# EAGLE schematic alt-com (EAGLE 7.2.0)
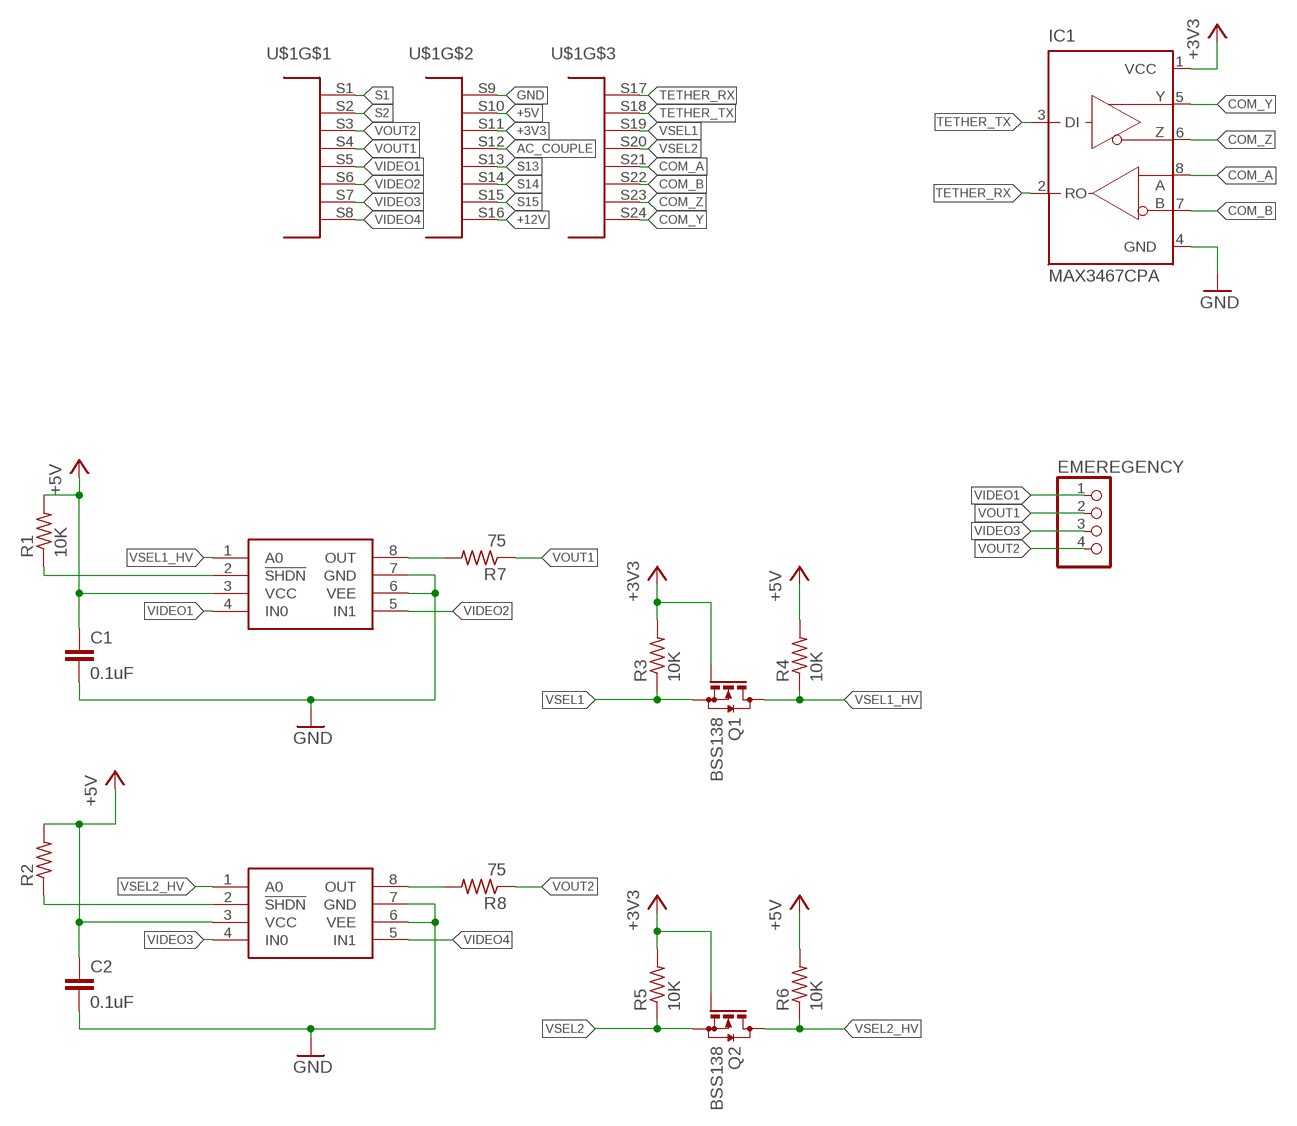
[diagram p0: schematic, sheet 1]

## Parts
C1  0.1uF  C-EUC0603  [C0603]
C2  0.1uF  C-EUC0603  [C0603]
EMEREGENCY  PINHD-1X4  [1X04]
IC1  MAX3467CPA  [SO08]
Q1  BSS138  BSS123  [SOT23]
Q2  BSS138  BSS123  [SOT23]
R1  10K  R-US_R0603  [R0603]
R2  R-US_R0603  [R0603]
R3  10K  R-US_R0603  [R0603]
R4  10K  R-US_R0603  [R0603]
R5  10K  R-US_R0603  [R0603]
R6  10K  R-US_R0603  [R0603]
R7  75  R-US_R0603  [R0603]
R8  75  R-US_R0603  [R0603]
U$1  TEN60-S24-RA-2  [TEN60-S24-RA-2]
U$2  MAX4313  [UMAX]
U$3  MAX4313  [UMAX]

## Nets
+3V3: IC1.1(VCC) Q1.1(G) Q2.1(G) R3.2 R5.2 U$1.S11
+5V: C1.1 C2.1 R1.2 R2.2 R4.2 R6.2 U$1.S10 U$2.3(VCC) U$3.3(VCC)
+12V: U$1.S16
AC_COUPLE: U$1.S12
COM_A: IC1.8(A) U$1.S21
COM_B: IC1.7(B) U$1.S22
COM_Y: IC1.5(Y) U$1.S24
COM_Z: IC1.6(Z) U$1.S23
GND: C1.2 C2.2 IC1.4(GND) U$1.S9 U$2.6(VEE) U$2.7(GND) U$3.6(VEE) U$3.7(GND)
N$1: R1.1 U$2.2(!SHDN)
N$2: R7.2 U$2.8(OUT)
N$3: R8.2 U$3.8(OUT)
N$8: R2.1 U$3.2(!SHDN)
S1: U$1.S1
S2: U$1.S2
S13: U$1.S13
S14: U$1.S14
S15: U$1.S15
TETHER_RX: IC1.2(RO) U$1.S17
TETHER_TX: IC1.3(DI) U$1.S18
VIDEO1: EMEREGENCY.1 U$1.S5 U$2.4(IN0)
VIDEO2: U$1.S6 U$2.5(IN1)
VIDEO3: EMEREGENCY.3 U$1.S7 U$3.4(IN0)
VIDEO4: U$1.S8 U$3.5(IN1)
VOUT1: EMEREGENCY.2 R7.1 U$1.S4
VOUT2: EMEREGENCY.4 R8.1 U$1.S3
VSEL1: Q1.2(S) R3.1 U$1.S19
VSEL1_HV: Q1.3(D) R4.1 U$2.1(A0)
VSEL2: Q2.2(S) R5.1 U$1.S20
VSEL2_HV: Q2.3(D) R6.1 U$3.1(A0)

## Library data of the parts
C1 C2 = resistor:C-EU: CAPACITOR, European symbol
EMEREGENCY = pinhead:PINHD-1X4: PIN HEADER
IC1 = maxim:MAX3467*: +5V, Fail-Safe, 40Mbps, Profibus RS-485/RS-422 Transceivers Source: MAX3465-MAX3469.pdf; OC_FARNELL: unknown; OC_NEWARK: unknown
Q1 Q2 = transistor-small-signal:BSS123: N-CHANNEL MOS FET
R1-R8 = resistor:R-US_: RESISTOR, American symbol
U$1 = BackplaneConnector:TEN60-S24-RA-2
U$2 U$3 = MicroBoard:MAX4313